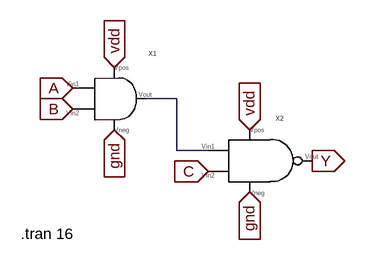
[diagram p0: schematic nand3.asc]
nand3.asc, the LTspice schematic file:
Version 4
SHEET 1 880 680
WIRE 272 112 224 112
WIRE 272 192 272 112
WIRE 320 192 272 192
FLAG 176 64 vdd
IOPIN 176 64 In
FLAG 384 160 vdd
IOPIN 384 160 In
FLAG 176 160 gnd
IOPIN 176 160 In
FLAG 384 256 gnd
IOPIN 384 256 In
FLAG 480 208 Y
IOPIN 480 208 Out
FLAG 112 96 A
IOPIN 112 96 In
FLAG 112 128 B
IOPIN 112 128 In
FLAG 320 224 C
IOPIN 320 224 In
SYMBOL nand 384 208 R0
SYMATTR InstName X2
SYMBOL and 208 112 R0
SYMATTR InstName X1
TEXT 32 320 Left 2 !.tran 16

The netlist it stands for:
* nand3.asc
XX2 N001 C vdd gnd Y nand  ; pins A B vdd gnd Y
XX1 vdd A B gnd N001 and  ; pins vdd A B gnd Y
.tran 16
.backanno
.end